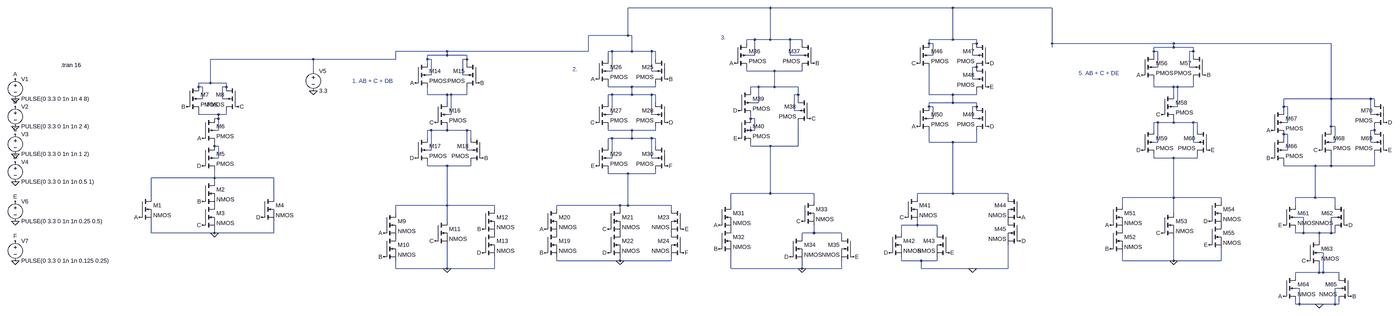
[diagram p0: schematic CMOS_Complex_logic.asc, whole sheet]
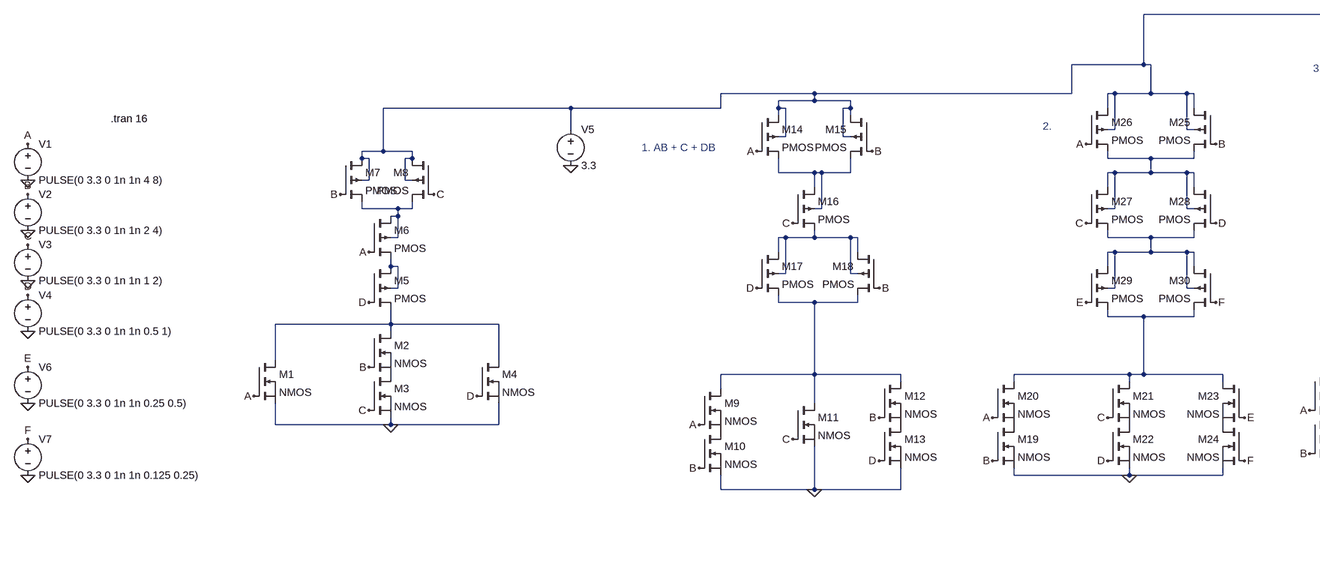
[diagram p1: schematic CMOS_Complex_logic.asc, part, row 1 of 1, column 1 of 2]
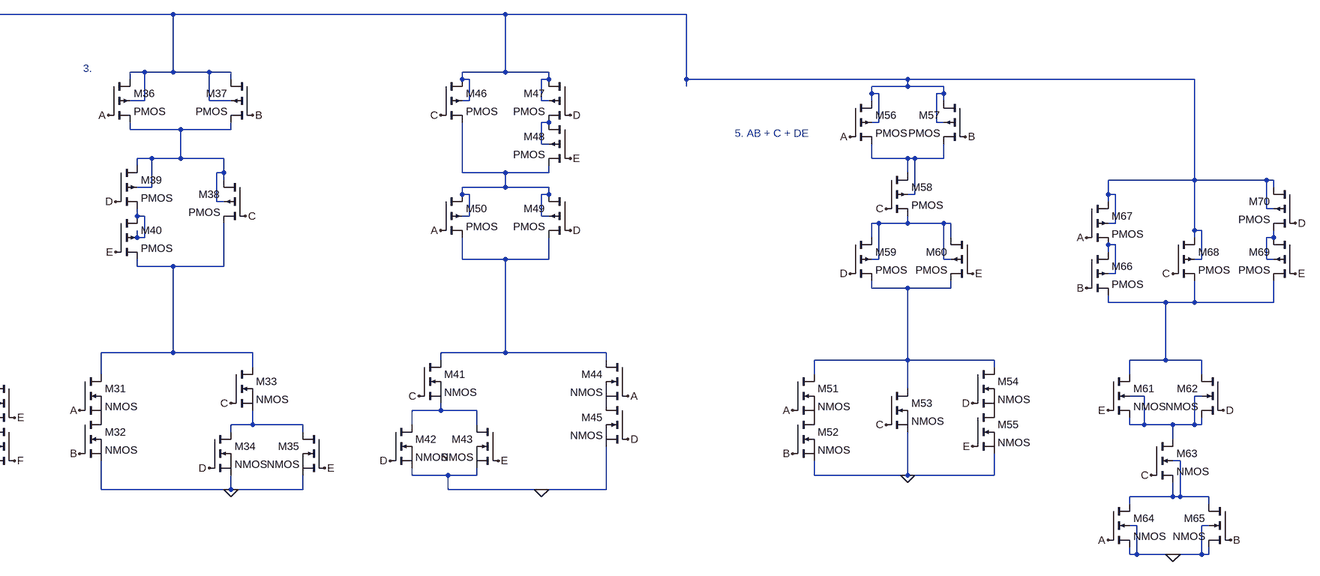
[diagram p2: schematic CMOS_Complex_logic.asc, part, row 1 of 1, column 2 of 2]
CMOS_Complex_logic.asc, the LTspice schematic file:
Version 4
SHEET 1 7924 908
WIRE 4736 -320 3504 -320
WIRE 6016 -320 4736 -320
WIRE 6448 -320 6016 -320
WIRE 3504 -208 3504 -320
WIRE 3504 -208 3344 -208
WIRE 3520 -208 3504 -208
WIRE 4672 -192 4640 -192
WIRE 4736 -192 4736 -320
WIRE 4736 -192 4672 -192
WIRE 4816 -192 4736 -192
WIRE 4864 -192 4816 -192
WIRE 6016 -192 6016 -320
WIRE 6016 -192 5920 -192
WIRE 6112 -192 6016 -192
WIRE 4640 -176 4640 -192
WIRE 4864 -176 4864 -192
WIRE 5920 -176 5920 -192
WIRE 5936 -176 5920 -176
WIRE 6112 -176 6112 -192
WIRE 6112 -176 6096 -176
WIRE 6448 -176 6448 -320
WIRE 6960 -176 6448 -176
WIRE 7664 -176 6960 -176
WIRE 6448 -160 6448 -176
WIRE 6960 -160 6960 -176
WIRE 6960 -160 6880 -160
WIRE 7040 -160 6960 -160
WIRE 2352 -144 2144 -144
WIRE 3344 -144 3344 -208
WIRE 3344 -144 2352 -144
WIRE 3440 -144 3424 -144
WIRE 3520 -144 3520 -208
WIRE 3520 -144 3440 -144
WIRE 3600 -144 3520 -144
WIRE 3616 -144 3600 -144
WIRE 6880 -144 6880 -160
WIRE 6896 -144 6880 -144
WIRE 7040 -144 7040 -160
WIRE 7040 -144 7024 -144
WIRE 2352 -128 2352 -144
WIRE 2352 -128 2272 -128
WIRE 2432 -128 2352 -128
WIRE 4672 -128 4672 -192
WIRE 4672 -128 4640 -128
WIRE 4816 -128 4816 -192
WIRE 4864 -128 4816 -128
WIRE 5936 -128 5936 -176
WIRE 5936 -128 5920 -128
WIRE 6096 -128 6096 -176
WIRE 6112 -128 6096 -128
WIRE 6880 -128 6880 -144
WIRE 7040 -128 7040 -144
WIRE 1392 -112 976 -112
WIRE 2144 -112 2144 -144
WIRE 2144 -112 1392 -112
WIRE 2272 -112 2272 -128
WIRE 2288 -112 2272 -112
WIRE 2432 -112 2432 -128
WIRE 2432 -112 2416 -112
WIRE 3424 -112 3424 -144
WIRE 3616 -112 3616 -144
WIRE 2272 -96 2272 -112
WIRE 2432 -96 2432 -112
WIRE 6112 -80 6096 -80
WIRE 6896 -80 6896 -144
WIRE 6896 -80 6880 -80
WIRE 7024 -80 7024 -144
WIRE 7040 -80 7024 -80
WIRE 1392 -64 1392 -112
WIRE 3440 -64 3440 -144
WIRE 3440 -64 3424 -64
WIRE 3600 -64 3600 -144
WIRE 3616 -64 3600 -64
WIRE 4640 -64 4640 -80
WIRE 4752 -64 4640 -64
WIRE 4864 -64 4864 -80
WIRE 4864 -64 4752 -64
WIRE 2288 -48 2288 -112
WIRE 2288 -48 2272 -48
WIRE 2416 -48 2416 -112
WIRE 2432 -48 2416 -48
WIRE 6096 -32 6096 -80
WIRE 6112 -32 6096 -32
WIRE 976 -16 976 -112
WIRE 976 -16 928 -16
WIRE 1040 -16 976 -16
WIRE 928 0 928 -16
WIRE 944 0 928 0
WIRE 1040 0 1040 -16
WIRE 1040 0 1024 0
WIRE 3424 0 3424 -16
WIRE 3520 0 3424 0
WIRE 3616 0 3616 -16
WIRE 3616 0 3520 0
WIRE 4688 0 4656 0
WIRE 4752 0 4752 -64
WIRE 4752 0 4688 0
WIRE 4848 0 4752 0
WIRE 6880 0 6880 -32
WIRE 6960 0 6880 0
WIRE 6976 0 6960 0
WIRE 7040 0 7040 -32
WIRE 7040 0 6976 0
WIRE 4656 16 4656 0
WIRE 2272 32 2272 0
WIRE 2352 32 2272 32
WIRE 2368 32 2352 32
WIRE 2432 32 2432 0
WIRE 2432 32 2368 32
WIRE 3440 32 3424 32
WIRE 3520 32 3520 0
WIRE 3520 32 3440 32
WIRE 3600 32 3520 32
WIRE 3616 32 3600 32
WIRE 4848 32 4848 0
WIRE 4848 32 4832 32
WIRE 5920 32 5920 -80
WIRE 6016 32 5920 32
WIRE 6112 32 6112 16
WIRE 6112 32 6016 32
WIRE 6960 32 6960 0
WIRE 944 48 944 0
WIRE 944 48 928 48
WIRE 1024 48 1024 0
WIRE 1040 48 1024 48
WIRE 4848 48 4848 32
WIRE 7664 48 7664 -176
WIRE 7664 48 7472 48
WIRE 7824 48 7664 48
WIRE 7840 48 7824 48
WIRE 2352 64 2352 32
WIRE 3424 64 3424 32
WIRE 3616 64 3616 32
WIRE 4688 64 4688 0
WIRE 4688 64 4656 64
WIRE 6016 64 6016 32
WIRE 6016 64 5920 64
WIRE 6112 64 6016 64
WIRE 7840 64 7840 48
WIRE 5920 80 5920 64
WIRE 5936 80 5920 80
WIRE 6112 80 6112 64
WIRE 6112 80 6096 80
WIRE 6976 80 6976 0
WIRE 6976 80 6960 80
WIRE 7472 80 7472 48
WIRE 7488 80 7472 80
WIRE 4832 96 4832 32
WIRE 4848 96 4832 96
WIRE 7472 96 7472 80
WIRE 928 112 928 96
WIRE 1008 112 928 112
WIRE 1040 112 1040 96
WIRE 1040 112 1008 112
WIRE 2368 112 2368 32
WIRE 2368 112 2352 112
WIRE 3440 112 3440 32
WIRE 3440 112 3424 112
WIRE 3600 112 3600 32
WIRE 3616 112 3600 112
WIRE 7824 112 7824 48
WIRE 7840 112 7824 112
WIRE 1008 128 1008 112
WIRE 1008 128 992 128
WIRE 4656 128 4656 112
WIRE 4672 128 4656 128
WIRE 5936 128 5936 80
WIRE 5936 128 5920 128
WIRE 6096 128 6096 80
WIRE 6112 128 6096 128
WIRE 6896 144 6880 144
WIRE 6960 144 6960 128
WIRE 6960 144 6896 144
WIRE 7040 144 6960 144
WIRE 7056 144 7040 144
WIRE 7488 144 7488 80
WIRE 7488 144 7472 144
WIRE 7664 160 7664 48
WIRE 7680 160 7664 160
WIRE 1008 176 1008 128
WIRE 1008 176 992 176
WIRE 2288 176 2272 176
WIRE 2352 176 2352 160
WIRE 2352 176 2288 176
WIRE 2432 176 2352 176
WIRE 2448 176 2432 176
WIRE 3424 176 3424 160
WIRE 3520 176 3424 176
WIRE 3616 176 3616 160
WIRE 3616 176 3520 176
WIRE 4656 176 4656 160
WIRE 4672 176 4672 128
WIRE 4672 176 4656 176
WIRE 6880 176 6880 144
WIRE 7056 176 7056 144
WIRE 7664 176 7664 160
WIRE 7840 176 7840 160
WIRE 7840 176 7824 176
WIRE 7488 192 7472 192
WIRE 2272 208 2272 176
WIRE 2448 208 2448 176
WIRE 3440 208 3424 208
WIRE 3520 208 3520 176
WIRE 3520 208 3440 208
WIRE 3600 208 3520 208
WIRE 3616 208 3600 208
WIRE 7472 208 7472 192
WIRE 5920 224 5920 176
WIRE 6016 224 5920 224
WIRE 6112 224 6112 176
WIRE 6112 224 6016 224
WIRE 6896 224 6896 144
WIRE 6896 224 6880 224
WIRE 7040 224 7040 144
WIRE 7056 224 7040 224
WIRE 7680 224 7680 160
WIRE 7680 224 7664 224
WIRE 7824 224 7824 176
WIRE 7840 224 7824 224
WIRE 992 240 992 224
WIRE 1008 240 992 240
WIRE 3424 240 3424 208
WIRE 3616 240 3616 208
WIRE 4656 240 4656 224
WIRE 4736 240 4656 240
WIRE 4848 240 4848 144
WIRE 4848 240 4736 240
WIRE 2288 256 2288 176
WIRE 2288 256 2272 256
WIRE 2432 256 2432 176
WIRE 2448 256 2432 256
WIRE 7488 256 7488 192
WIRE 7488 256 7472 256
WIRE 1008 288 1008 240
WIRE 1008 288 992 288
WIRE 3440 288 3440 208
WIRE 3440 288 3424 288
WIRE 3600 288 3600 208
WIRE 3616 288 3600 288
WIRE 6880 288 6880 272
WIRE 6960 288 6880 288
WIRE 7056 288 7056 272
WIRE 7056 288 6960 288
WIRE 2272 320 2272 304
WIRE 2352 320 2272 320
WIRE 2448 320 2448 304
WIRE 2448 320 2352 320
WIRE 7472 320 7472 304
WIRE 7600 320 7472 320
WIRE 7664 320 7664 272
WIRE 7664 320 7600 320
WIRE 7840 320 7840 272
WIRE 7840 320 7664 320
WIRE 3424 352 3424 336
WIRE 3504 352 3424 352
WIRE 3616 352 3616 336
WIRE 3616 352 3504 352
WIRE 992 368 992 336
WIRE 992 368 736 368
WIRE 1232 368 992 368
WIRE 992 384 992 368
WIRE 4736 432 4736 240
WIRE 4736 432 4576 432
WIRE 4912 432 4736 432
WIRE 6016 432 6016 224
WIRE 6016 432 5872 432
WIRE 6240 432 6016 432
WIRE 736 448 736 368
WIRE 1232 448 1232 368
WIRE 5872 448 5872 432
WIRE 6240 448 6240 432
WIRE 6960 448 6960 288
WIRE 6960 448 6752 448
WIRE 7152 448 6960 448
WIRE 7600 448 7600 320
WIRE 7600 448 7520 448
WIRE 7680 448 7600 448
WIRE 4912 464 4912 432
WIRE 7152 464 7152 448
WIRE 2352 480 2352 320
WIRE 2352 480 2144 480
WIRE 2544 480 2352 480
WIRE 3472 480 3216 480
WIRE 3504 480 3504 352
WIRE 3504 480 3472 480
WIRE 3680 480 3504 480
WIRE 4576 480 4576 432
WIRE 6752 480 6752 448
WIRE 7520 480 7520 448
WIRE 7680 480 7680 448
WIRE 2544 496 2544 480
WIRE 3216 496 3216 480
WIRE 3472 496 3472 480
WIRE 3680 496 3680 480
WIRE 2144 512 2144 480
WIRE 6960 512 6960 448
WIRE 7552 528 7520 528
WIRE 7680 528 7664 528
WIRE 2352 544 2352 480
WIRE 5872 560 5872 544
WIRE 5872 560 5808 560
WIRE 5952 560 5872 560
WIRE 736 592 736 544
WIRE 992 592 992 576
WIRE 992 592 736 592
WIRE 1232 592 1232 544
WIRE 1232 592 992 592
WIRE 4912 592 4912 560
WIRE 4912 592 4864 592
WIRE 5024 592 4912 592
WIRE 5808 592 5808 560
WIRE 5952 592 5952 560
WIRE 7520 592 7520 576
WIRE 7552 592 7552 528
WIRE 7552 592 7520 592
WIRE 7616 592 7552 592
WIRE 7664 592 7664 528
WIRE 7664 592 7616 592
WIRE 7680 592 7680 576
WIRE 7680 592 7664 592
WIRE 4864 608 4864 592
WIRE 5024 608 5024 592
WIRE 7616 624 7616 592
WIRE 7632 672 7616 672
WIRE 3216 704 3216 688
WIRE 3472 704 3472 688
WIRE 3472 704 3216 704
WIRE 3680 704 3680 688
WIRE 3680 704 3472 704
WIRE 5808 704 5808 688
WIRE 5888 704 5808 704
WIRE 5952 704 5952 688
WIRE 5952 704 5888 704
WIRE 6752 704 6752 672
WIRE 6960 704 6960 608
WIRE 6960 704 6752 704
WIRE 7152 704 7152 656
WIRE 7152 704 6960 704
WIRE 2144 736 2144 704
WIRE 2352 736 2352 640
WIRE 2352 736 2144 736
WIRE 2544 736 2544 688
WIRE 2544 736 2352 736
WIRE 4576 736 4576 672
WIRE 4864 736 4864 704
WIRE 4864 736 4576 736
WIRE 5024 736 5024 704
WIRE 5024 736 4864 736
WIRE 5888 736 5888 704
WIRE 6096 736 5888 736
WIRE 6240 736 6240 640
WIRE 6240 736 6096 736
WIRE 7616 752 7616 720
WIRE 7616 752 7520 752
WIRE 7632 752 7632 672
WIRE 7632 752 7616 752
WIRE 7696 752 7632 752
WIRE 7520 768 7520 752
WIRE 7696 768 7696 752
WIRE 7536 816 7520 816
WIRE 7696 816 7680 816
WIRE 7520 880 7520 864
WIRE 7536 880 7536 816
WIRE 7536 880 7520 880
WIRE 7616 880 7536 880
WIRE 7680 880 7680 816
WIRE 7680 880 7616 880
WIRE 7696 880 7696 864
WIRE 7696 880 7680 880
FLAG -96 48 0
FLAG -96 160 0
FLAG -96 272 0
FLAG -96 384 0
FLAG 1392 16 0
FLAG -96 -32 A
FLAG 688 528 A
FLAG 944 208 A
FLAG -96 80 B
FLAG 880 80 B
FLAG 944 464 B
FLAG -96 192 C
FLAG 1088 80 C
FLAG 944 560 C
FLAG -96 304 D
FLAG 944 320 D
FLAG 1184 528 D
FLAG 992 592 0
FLAG 2352 736 0
FLAG 2096 592 A
FLAG 2224 -16 A
FLAG 2096 688 B
FLAG 2480 -16 B
FLAG 2496 576 B
FLAG 2496 288 B
FLAG 2304 624 C
FLAG 2304 144 C
FLAG 2224 288 D
FLAG 2496 672 D
FLAG 3664 -32 B
FLAG 3376 -32 A
FLAG 3376 144 C
FLAG 3664 144 D
FLAG 3376 320 E
FLAG 3664 320 F
FLAG 3168 576 A
FLAG 3168 672 B
FLAG 3424 576 C
FLAG 3424 672 D
FLAG 3728 576 E
FLAG 3728 672 F
FLAG 4864 736 0
FLAG 4592 -96 A
FLAG 4528 560 A
FLAG 4912 -96 B
FLAG 4528 656 B
FLAG 4864 544 C
FLAG 4896 128 C
FLAG 4816 688 D
FLAG 4608 96 D
FLAG 4608 208 E
FLAG 5072 688 E
FLAG 6096 736 0
FLAG 5872 160 A
FLAG 6288 528 A
FLAG 6160 160 D
FLAG 6288 624 D
FLAG 5760 672 D
FLAG 6160 -96 D
FLAG 6160 0 E
FLAG 6000 672 E
FLAG 5824 528 C
FLAG 5872 -96 C
FLAG 6960 704 0
FLAG 6704 560 A
FLAG 6832 -48 A
FLAG 6704 656 B
FLAG 7088 -48 B
FLAG 7104 544 D
FLAG 7104 256 E
FLAG 6912 592 C
FLAG 6912 112 C
FLAG 6832 256 D
FLAG 7104 640 E
FLAG -96 544 0
FLAG -96 464 E
FLAG -96 704 0
FLAG -96 624 F
FLAG 3472 704 0
FLAG 7616 880 0
FLAG 7424 176 A
FLAG 7472 848 A
FLAG 7424 288 B
FLAG 7744 848 B
FLAG 7568 704 C
FLAG 7616 256 C
FLAG 7888 144 D
FLAG 7728 560 D
FLAG 7888 256 E
FLAG 7472 560 E
SYMBOL voltage -96 -48 R0
WINDOW 123 0 0 Left 0
WINDOW 39 0 0 Left 0
SYMATTR InstName V1
SYMATTR Value PULSE(0 3.3 0 1n 1n 4 8)
SYMBOL voltage -96 64 R0
SYMATTR InstName V2
SYMATTR Value PULSE(0 3.3 0 1n 1n 2 4)
SYMBOL voltage -96 176 R0
SYMATTR InstName V3
SYMATTR Value PULSE(0 3.3 0 1n 1n 1 2)
SYMBOL voltage -96 288 R0
SYMATTR InstName V4
SYMATTR Value PULSE(0 3.3 0 1n 1n 0.5 1)
SYMBOL nmos 688 448 R0
SYMATTR InstName M1
SYMBOL nmos 944 384 R0
SYMATTR InstName M2
SYMBOL nmos 944 480 R0
SYMATTR InstName M3
SYMBOL nmos 1184 448 R0
SYMATTR InstName M4
SYMBOL pmos4 944 240 R0
SYMATTR InstName M5
SYMBOL pmos4 944 128 R0
SYMATTR InstName M6
SYMBOL pmos4 880 0 R0
SYMATTR InstName M7
SYMBOL pmos4 1088 0 M0
SYMATTR InstName M8
SYMBOL voltage 1392 -80 R0
SYMATTR InstName V5
SYMATTR Value 3.3
SYMBOL nmos 2096 512 R0
SYMATTR InstName M9
SYMBOL nmos 2096 608 R0
SYMATTR InstName M10
SYMBOL nmos 2304 544 R0
SYMATTR InstName M11
SYMBOL nmos 2496 496 R0
SYMATTR InstName M12
SYMBOL nmos 2496 592 R0
SYMATTR InstName M13
SYMBOL pmos4 2224 -96 R0
SYMATTR InstName M14
SYMBOL pmos4 2480 -96 M0
SYMATTR InstName M15
SYMBOL pmos4 2304 64 R0
SYMATTR InstName M16
SYMBOL pmos4 2224 208 R0
SYMATTR InstName M17
SYMBOL pmos4 2496 208 M0
SYMATTR InstName M18
SYMBOL nmos 3168 592 R0
SYMATTR InstName M19
SYMBOL nmos 3168 496 R0
SYMATTR InstName M20
SYMBOL nmos 3424 496 R0
SYMATTR InstName M21
SYMBOL nmos 3424 592 R0
SYMATTR InstName M22
SYMBOL nmos 3728 496 M0
SYMATTR InstName M23
SYMBOL nmos 3728 592 M0
SYMATTR InstName M24
SYMBOL pmos4 3664 -112 M0
SYMATTR InstName M25
SYMBOL pmos4 3376 -112 R0
SYMATTR InstName M26
SYMBOL pmos4 3376 64 R0
SYMATTR InstName M27
SYMBOL pmos4 3664 64 M0
SYMATTR InstName M28
SYMBOL pmos4 3376 240 R0
SYMATTR InstName M29
SYMBOL pmos4 3664 240 M0
SYMATTR InstName M30
SYMBOL nmos 4528 480 R0
SYMATTR InstName M31
SYMBOL nmos 4528 576 R0
SYMATTR InstName M32
SYMBOL nmos 4864 464 R0
SYMATTR InstName M33
SYMBOL nmos 4816 608 R0
SYMATTR InstName M34
SYMBOL nmos 5072 608 M0
SYMATTR InstName M35
SYMBOL pmos4 4592 -176 R0
SYMATTR InstName M36
SYMBOL pmos4 4912 -176 M0
SYMATTR InstName M37
SYMBOL pmos4 4896 48 M0
SYMATTR InstName M38
SYMBOL pmos4 4608 16 R0
SYMATTR InstName M39
SYMBOL pmos4 4608 128 R0
SYMATTR InstName M40
SYMBOL nmos 5824 448 R0
SYMATTR InstName M41
SYMBOL nmos 5760 592 R0
SYMATTR InstName M42
SYMBOL nmos 6000 592 M0
SYMATTR InstName M43
SYMBOL nmos 6288 448 M0
SYMATTR InstName M44
SYMBOL nmos 6288 544 M0
SYMATTR InstName M45
SYMBOL pmos4 5872 -176 R0
SYMATTR InstName M46
SYMBOL pmos4 6160 -176 M0
SYMATTR InstName M47
SYMBOL pmos4 6160 -80 M0
SYMATTR InstName M48
SYMBOL pmos4 6160 80 M0
SYMATTR InstName M49
SYMBOL pmos4 5872 80 R0
SYMATTR InstName M50
SYMBOL nmos 6704 480 R0
SYMATTR InstName M51
SYMBOL nmos 6704 576 R0
SYMATTR InstName M52
SYMBOL nmos 6912 512 R0
SYMATTR InstName M53
SYMBOL nmos 7104 464 R0
SYMATTR InstName M54
SYMBOL nmos 7104 560 R0
SYMATTR InstName M55
SYMBOL pmos4 6832 -128 R0
SYMATTR InstName M56
SYMBOL pmos4 7088 -128 M0
SYMATTR InstName M57
SYMBOL pmos4 6912 32 R0
SYMATTR InstName M58
SYMBOL pmos4 6832 176 R0
SYMATTR InstName M59
SYMBOL pmos4 7104 176 M0
SYMATTR InstName M60
SYMBOL voltage -96 448 R0
SYMATTR InstName V6
SYMATTR Value PULSE(0 3.3 0 1n 1n 0.25 0.5)
SYMBOL voltage -96 608 R0
SYMATTR InstName V7
SYMATTR Value PULSE(0 3.3 0 1n 1n 0.125 0.25)
SYMBOL nmos4 7472 480 R0
SYMATTR InstName M61
SYMBOL nmos4 7728 480 M0
SYMATTR InstName M62
SYMBOL nmos4 7568 624 R0
SYMATTR InstName M63
SYMBOL nmos4 7472 768 R0
SYMATTR InstName M64
SYMBOL nmos4 7744 768 M0
SYMATTR InstName M65
SYMBOL pmos4 7424 208 R0
SYMATTR InstName M66
SYMBOL pmos4 7424 96 R0
SYMATTR InstName M67
SYMBOL pmos4 7616 176 R0
SYMATTR InstName M68
SYMBOL pmos4 7888 176 M0
SYMATTR InstName M69
SYMBOL pmos4 7888 64 M0
SYMATTR InstName M70
TEXT 88 -88 Left 2 !.tran 16
TEXT 1968 -24 Left 2 ;1. AB + C + DB
TEXT 4536 -200 Left 2 ;3.
TEXT 3280 -72 Left 2 ;2.
TEXT 6576 -56 Left 2 ;5. AB + C + DE

The netlist it stands for:
* CMOS_Complex_logic.asc
V1 A 0 PULSE(0 3.3 0 1n 1n 4 8)
V2 B 0 PULSE(0 3.3 0 1n 1n 2 4)
V3 C 0 PULSE(0 3.3 0 1n 1n 1 2)
V4 D 0 PULSE(0 3.3 0 1n 1n 0.5 1)
M1 N022 A 0 0 NMOS
M2 N022 B P001 P001 NMOS
M3 P001 C 0 0 NMOS
M4 N022 D 0 0 NMOS
M5 N016 D N022 N016 PMOS
M6 N008 A N016 N008 PMOS
M7 N001 B N008 N001 PMOS
M8 N001 C N008 N001 PMOS
V5 N001 0 3.3
M9 N019 A P002 P002 NMOS
M10 P002 B 0 0 NMOS
M11 N019 C 0 0 NMOS
M12 N019 B P003 P003 NMOS
M13 P003 D 0 0 NMOS
M14 N001 A N006 N001 PMOS
M15 N001 B N006 N001 PMOS
M16 N006 C N011 N006 PMOS
M17 N011 D N019 N011 PMOS
M18 N011 B N019 N011 PMOS
M19 P004 B 0 0 NMOS
M20 N021 A P004 P004 NMOS
M21 N021 C P005 P005 NMOS
M22 P005 D 0 0 NMOS
M23 N021 E P006 P006 NMOS
M24 P006 F 0 0 NMOS
M25 N001 B N004 N001 PMOS
M26 N001 A N004 N001 PMOS
M27 N004 C N012 N004 PMOS
M28 N004 D N012 N004 PMOS
M29 N012 E N021 N012 PMOS
M30 N012 F N021 N012 PMOS
M31 N017 A P007 P007 NMOS
M32 P007 B 0 0 NMOS
M33 N017 C N025 N025 NMOS
M34 N025 D 0 0 NMOS
M35 N025 E 0 0 NMOS
M36 N001 A N003 N001 PMOS
M37 N001 B N003 N001 PMOS
M38 N003 C N017 N003 PMOS
M39 N003 D N009 N003 PMOS
M40 N009 E N017 N009 PMOS
M41 N015 C N024 N024 NMOS
M42 N024 D 0 0 NMOS
M43 N024 E 0 0 NMOS
M44 N015 A P008 P008 NMOS
M45 P008 D 0 0 NMOS
M46 N001 C N007 N001 PMOS
M47 N001 D N002 N001 PMOS
M48 N002 E N007 N002 PMOS
M49 N007 D N015 N007 PMOS
M50 N007 A N015 N007 PMOS
M51 N018 A P009 P009 NMOS
M52 P009 B 0 0 NMOS
M53 N018 C 0 0 NMOS
M54 N018 D P010 P010 NMOS
M55 P010 E 0 0 NMOS
M56 N001 A N005 N001 PMOS
M57 N001 B N005 N001 PMOS
M58 N005 C N010 N005 PMOS
M59 N010 D N018 N010 PMOS
M60 N010 E N018 N010 PMOS
V6 E 0 PULSE(0 3.3 0 1n 1n 0.25 0.5)
V7 F 0 PULSE(0 3.3 0 1n 1n 0.125 0.25)
M61 N020 E N023 N023 NMOS
M62 N020 D N023 N023 NMOS
M63 N023 C N026 N026 NMOS
M64 N026 A 0 0 NMOS
M65 N026 B 0 0 NMOS
M66 N014 B N020 N014 PMOS
M67 N001 A N014 N001 PMOS
M68 N001 C N020 N001 PMOS
M69 N013 E N020 N013 PMOS
M70 N001 D N013 N001 PMOS
.model NMOS NMOS
.model PMOS PMOS
.lib standard.mos
.tran 16
* 1. AB + C + DB
* 3.
* 2.
* 5. AB + C + DE
.backanno
.end

* Results of the author's LTspice run, read from the files saved beside the schematic
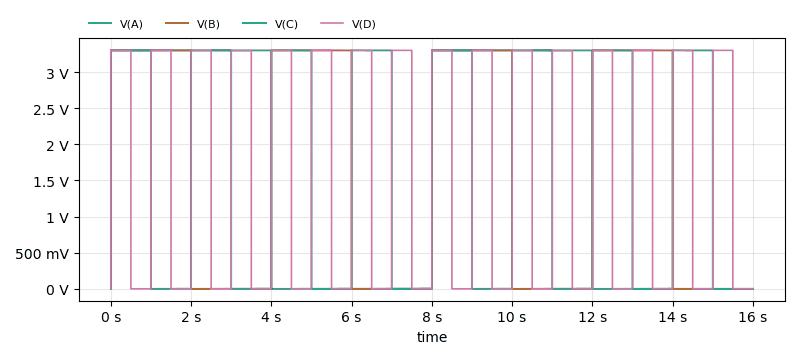
[diagram p3: Transient Analysis of CMOS_Complex_logic.asc, plotted from the saved traces]
* Transient Analysis, 1 run:
*   V(A): min 0 V, max 3.3 V, average 1.65 V, rms 2.333 V, last 0 V
*   V(B): min 0 V, max 3.3 V, average 1.65 V, rms 2.333 V, last 0 V
*   V(C): min 0 V, max 3.3 V, average 1.65 V, rms 2.333 V, last 0 V
*   V(D): min 0 V, max 3.3 V, average 1.65 V, rms 2.333 V, last 0 V